# Altium schematic sheet matrix.SchDoc
size A4; SheetNumber: 8; SheetTotal: 8
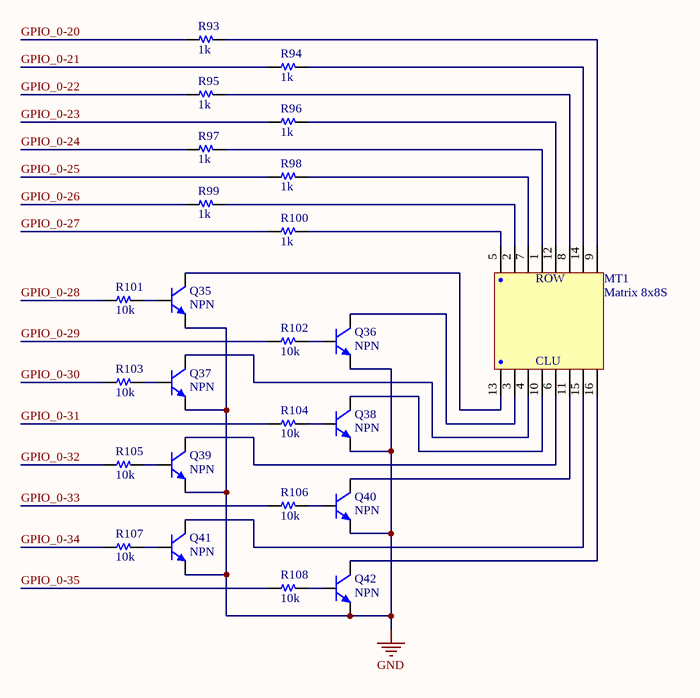
[diagram p0: matrix.SchDoc]

## Parts
MT1  Matrix 8x8S  [Led Matrix 1.9mm]
Q35  NPN  [SOT-23]
Q36  NPN  [SOT-23]
Q37  NPN  [SOT-23]
Q38  NPN  [SOT-23]
Q39  NPN  [SOT-23]
Q40  NPN  [SOT-23]
Q41  NPN  [SOT-23]
Q42  NPN  [SOT-23]
R93  1k  [R 0603]
R94  1k  [R 0603]
R95  1k  [R 0603]
R96  1k  [R 0603]
R97  1k  [R 0603]
R98  1k  [R 0603]
R99  1k  [R 0603]
R100  1k  [R 0603]
R101  10k  [R 0603]
R102  10k  [R 0603]
R103  10k  [R 0603]
R104  10k  [R 0603]
R105  10k  [R 0603]
R106  10k  [R 0603]
R107  10k  [R 0603]
R108  10k  [R 0603]

## Nets
GND: Q35.2(E) Q36.2(E) Q37.2(E) Q38.2(E) Q39.2(E) Q40.2(E) Q41.2(E) Q42.2(E)
GPIO_0-20: R93.1
GPIO_0-21: R94.1
GPIO_0-22: R95.1
GPIO_0-23: R96.1
GPIO_0-24: R97.1
GPIO_0-25: R98.1
GPIO_0-26: R99.1
GPIO_0-27: R100.1
GPIO_0-28: R101.1
GPIO_0-29: R102.1
GPIO_0-30: R103.1
GPIO_0-31: R104.1
GPIO_0-32: R105.1
GPIO_0-33: R106.1
GPIO_0-34: R107.1
GPIO_0-35: R108.1
NetMT1_1: MT1.1(H4) R97.2
NetMT1_2: MT1.2(H2) R99.2
NetMT1_3: MT1.3(C2) Q36.3(C)
NetMT1_4: MT1.4(C3) Q37.3(C)
NetMT1_5: MT1.5(H1) R100.2
NetMT1_6: MT1.6(C5) Q39.3(C)
NetMT1_7: MT1.7(H3) R98.2
NetMT1_8: MT1.8(H6) R95.2
NetMT1_9: MT1.9(H8) R93.2
NetMT1_10: MT1.10(C4) Q38.3(C)
NetMT1_11: MT1.11(C6) Q40.3(C)
NetMT1_12: MT1.12(H5) R96.2
NetMT1_13: MT1.13(C1) Q35.3(C)
NetMT1_14: MT1.14(H7) R94.2
NetMT1_15: MT1.15(C7) Q41.3(C)
NetMT1_16: MT1.16(C8) Q42.3(C)
NetQ35_1: Q35.1(B) R101.2
NetQ36_1: Q36.1(B) R102.2
NetQ37_1: Q37.1(B) R103.2
NetQ38_1: Q38.1(B) R104.2
NetQ39_1: Q39.1(B) R105.2
NetQ40_1: Q40.1(B) R106.2
NetQ41_1: Q41.1(B) R107.2
NetQ42_1: Q42.1(B) R108.2

## Notes on the sheet
- (in symbol LED 8x8S) ROW; CLU

## Library data of the parts
MT1 = LED 8x8S: Matrix 8x8,  Single colour; Value: Matrix 8x8S
Q35-Q42 = Transistor NPN: NPN Bipolar Transistor
R93-R108 = Resistor